# Altium schematic sheet Sheet_Project_Batteries_V2.SchDoc: Battery Board
size A4; Author: FloripaSat; CompanyName: UFSC - FloripaSat; DrawnBy: Amanda Batista Medeiros; Organization: UFSC- FloripaSat; Address1: University Campus - Trindade; Address2: Dep. of Electrical Engineering; Address3: Florianópolis, Santa Catarina, Brazil; Address4: CEP: 880040-900; Revision: V0.0; SheetNumber: 1; SheetTotal: 1
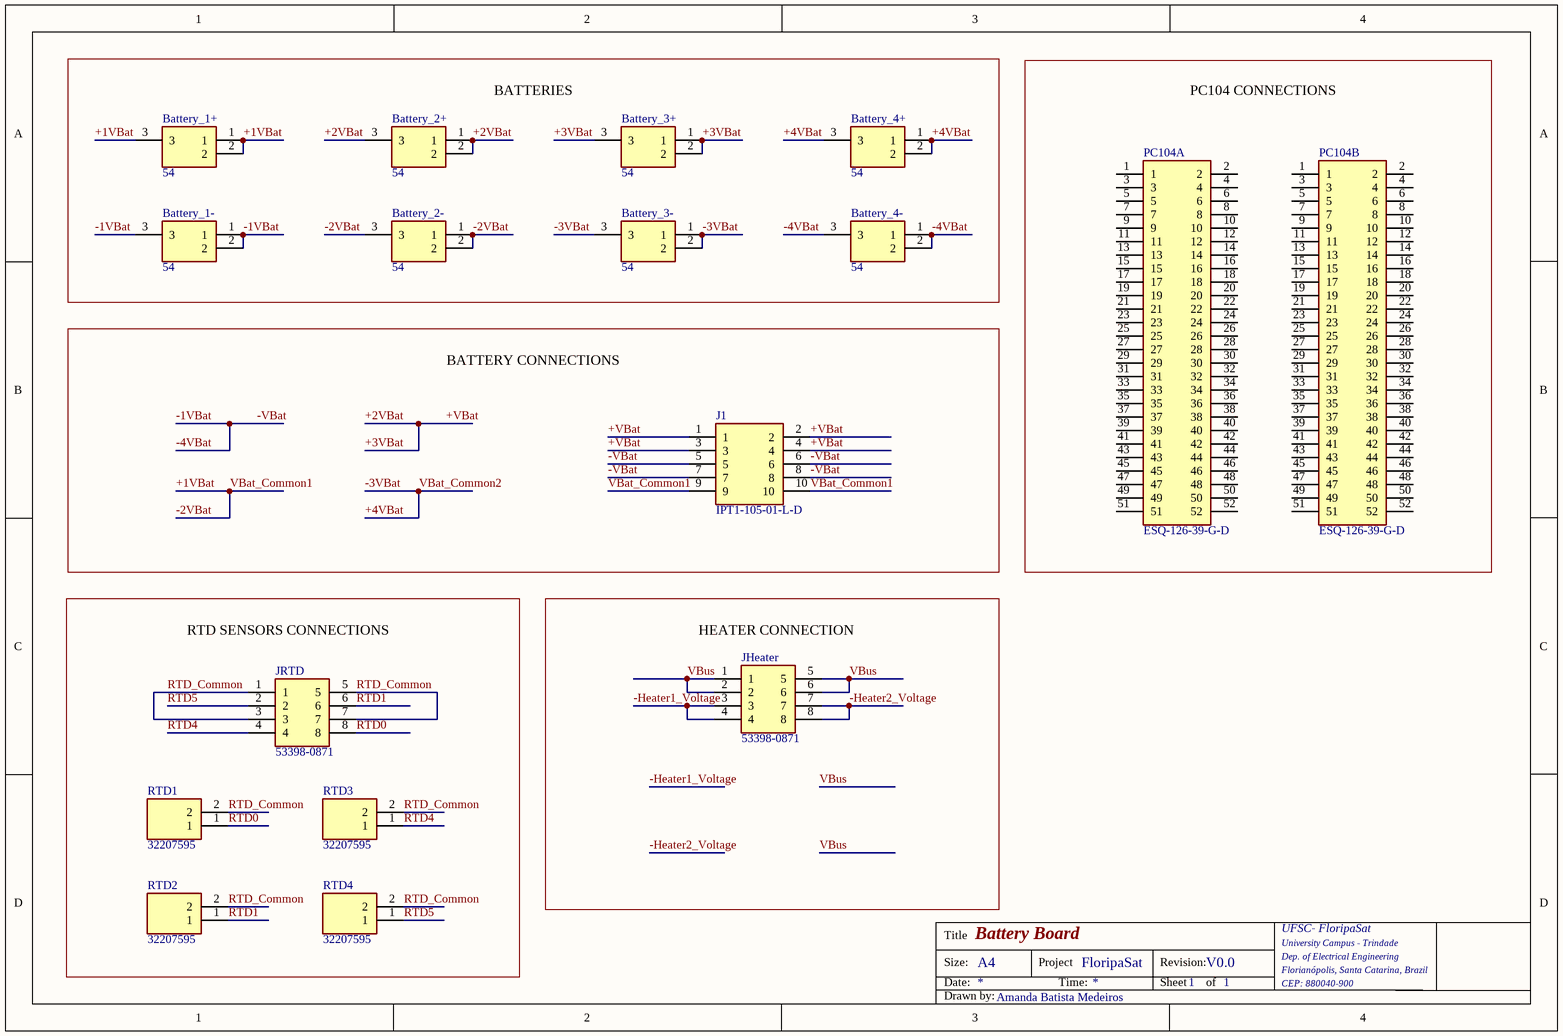
[diagram p0: Sheet_Project_Batteries_V2.SchDoc]

## Parts
Battery_1+  54  [54]
Battery_1-  54  [54]
Battery_2+  54  [54]
Battery_2-  54  [54]
Battery_3+  54  [54]
Battery_3-  54  [54]
Battery_4+  54  [54]
Battery_4-  54  [54]
J1  IPT1-105-01-L-D  [RHDR10W64P254_2X5_1321X508X635P]
JHeater  53398-0871  [53398-0871]
JRTD  53398-0871  [53398-0871]
PC104A  ESQ-126-39-G-D  [SHDR52W64P254_2X26_6550X495X1384P]
PC104B  ESQ-126-39-G-D  [SHDR52W64P254_2X26_6550X495X1384P]
RTD1  32207595  [THRMC3216X70N]
RTD2  32207595  [THRMC3216X70N]
RTD3  32207595  [THRMC3216X70N]
RTD4  32207595  [THRMC3216X70N]

## Blocks framed on the sheet
BATTERIES: Battery_1+ Battery_1- Battery_2+ Battery_2- Battery_3+ Battery_3- Battery_4+ Battery_4-
PC104 CONNECTIONS: PC104A PC104B
BATTERY CONNECTIONS: J1
RTD SENSORS CONNECTIONS: JRTD RTD1-RTD4
HEATER CONNECTION: JHeater

## Nets
+1VBat: Battery_1+.1 Battery_1+.2 Battery_1+.3 Battery_2-.1 Battery_2-.2 Battery_2-.3 J1.9 J1.10  [also labelled -2VBat, VBat_Common1]
+2VBat: Battery_2+.1 Battery_2+.2 Battery_2+.3 Battery_3+.1 Battery_3+.2 Battery_3+.3 J1.1 J1.2 J1.3 J1.4  [also labelled +3VBat, +VBat]
+4VBat: Battery_3-.1 Battery_3-.2 Battery_3-.3 Battery_4+.1 Battery_4+.2 Battery_4+.3  [also labelled -3VBat, VBat_Common2]
-1VBat: Battery_1-.1 Battery_1-.2 Battery_1-.3 Battery_4-.1 Battery_4-.2 Battery_4-.3 J1.5 J1.6 J1.7 J1.8  [also labelled -4VBat, -VBat]
-Heater1_Voltage: JHeater.3 JHeater.4
-Heater2_Voltage: JHeater.7 JHeater.8
RTD0: JRTD.8 RTD1.1
RTD1: JRTD.6 RTD2.1
RTD4: JRTD.4 RTD3.1
RTD5: JRTD.2 RTD4.1
RTD_Common: JRTD.1 JRTD.3 JRTD.5 JRTD.7 RTD1.2 RTD2.2 RTD3.2 RTD4.2
VBus: JHeater.1 JHeater.2 JHeater.5 JHeater.6

Not connected (* = marked no-connect by the designer): PC104A 1 2 3 4 5 6 7 8 9 10 11 12 13 14 15 16 17 18 19 20 21 22 23 24 25 26 27 28 29 30 31 32 33 34 35 36 37 38 39 40 41 42 43 44 45 46 47 48 49 50 51 52; PC104B 1 2 3 4 5 6 7 8 9 10 11 12 13 14 15 16 17 18 19 20 21 22 23 24 25 26 27 28 29 30 31 32 33 34 35 36 37 38 39 40 41 42 43 44 45 46 47 48 49 50 51 52

## Notes on the sheet
- Title
- Size:
- Date:
- A4
- Project
- Time:
- Revision:
- Sheet
- of
- Drawn by:

## Library data of the parts
Battery_1+ Battery_1- Battery_2+ Battery_2- Battery_3+ Battery_3- Battery_4+ Battery_4- = 54: Battery; Manufacturer_Name: Keystone Electronics; Allied_Number: 70229904; Datasheet Link: http://www.farnell.com/datasheets/1703960.pdf; Manufacturer_Part_Number: 54; Mouser Part Number: 534-54; Mouser Price/Stock: https://www.mouser.co.uk/ProductDetail/Keystone-Electronics/54?qs=73q%2FgRcW4F3NakoJDesViw%3D%3D; Allied Price/Stock: http://www.alliedelec.com/keystone-electronics-54/70229904/
J1 = IPT1-105-01-L-D: Connector; Manufacturer_Name: SAMTEC; Datasheet Link: http://suddendocs.samtec.com/prints/ipt1-1xx-xx-xx-d-xx-mkt.pdf; Height: 6.35mm; Manufacturer_Part_Number: IPT1-105-01-L-D
JHeater JRTD = 53398-0871: Connector; Manufacturer_Name: Molex; Datasheet Link: https://componentsearchengine.com/Datasheets/1/53398-0871.pdf; Mouser2 Part Number: 538-53398-0871; Mouser2 Price/Stock: https://www.mouser.com/Search/Refine.aspx?Keyword=538-53398-0871; Manufacturer_Part_Number: 53398-0871
PC104A PC104B = ESQ-126-39-G-D: Connector; Manufacturer_Name: SAMTEC; Datasheet Link: http://suddendocs.samtec.com/catalog_english/esq_th.pdf; Height: 13.84mm; Manufacturer_Part_Number: ESQ-126-39-G-D; Mouser Part Number: 200-ESQ12639GD; Mouser Price/Stock: https://www.mouser.co.uk/ProductDetail/Samtec/ESQ-126-39-G-D?qs=Cqqh%252BS766wm7W672HSOlSA%3D%3D; RS Part Number: 1595654; RS Price/Stock: http://uk.rs-online.com/web/p/products/1595654
RTD1-RTD4 = 32207595: Integrated Circuit; Manufacturer_Name: Heraeus Nexensos; Datasheet Link: https://componentsearchengine.com/Datasheets/1/32207595.pdf; Height: 0.7mm; Manufacturer_Part_Number: 32207595